# EAGLE design motocontrolscience (EAGLE 6.5.0)
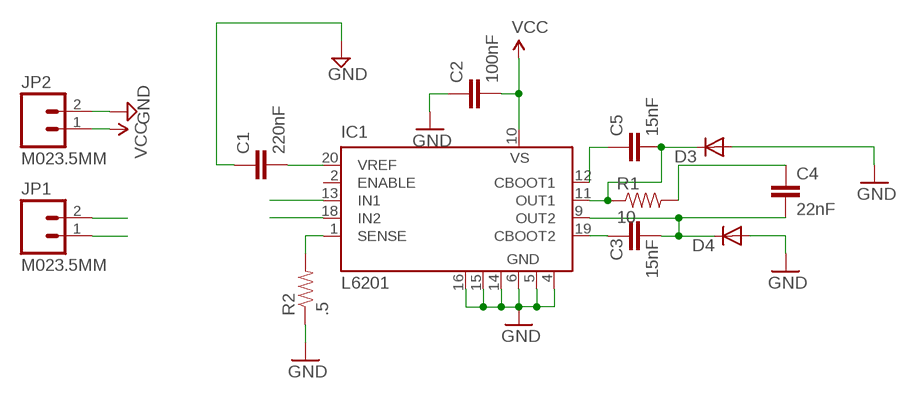
[diagram p0: schematic, sheet 1]

## Parts
C1  220nF  10UF-6.3V-20%(1206)  [1206]
C2  100nF  10UF-6.3V-20%(1206)  [1206]
C3  15nF  10UF-6.3V-20%(1206)  [1206]
C4  22nF  10UF-6.3V-20%(1206)  [1206]
C5  15nF  10UF-6.3V-20%(1206)  [1206]
D3  DIODE-DO214BA  [DO214BA]
D4  DIODE-DO214BA  [DO214BA]
IC1  L6201  [SO20]
JP1  M023.5MM  [SCREWTERMINAL-3.5MM-2]
JP2  M023.5MM  [SCREWTERMINAL-3.5MM-2]
R1  10  RESISTOR1206  [1206]
R2  .5  RESISTOR1206  [1206]

## Nets
GND: C1.1 C2.1 D3.A D4.A IC1.4(GND) IC1.5(GND) IC1.6(GND) IC1.14(GND) IC1.15(GND) IC1.16(GND) JP2.2 R2.1
N$2: C3.1 IC1.19(CBOOT2)
N$4: C4.1 R1.2
N$5: C5.1 IC1.12(CBOOT1)
N$6: C1.2 IC1.20(VREF)
N$7: IC1.1(SENSE) R2.2
N$8: IC1.13(IN1)
N$9: IC1.18(IN2)
OUT1: C5.2 D3.C IC1.11(OUT1) JP1.1 R1.1
OUT2: C3.2 C4.2 D4.C IC1.9(OUT2) JP1.2
VCC: C2.2 IC1.10(VS) JP2.1
Unconnected: IC1.2(ENABLE)

## Library data of the parts
C1-C5 = SparkFun-Capacitors:10UF-6.3V-20%(1206): CAP-10057 Ceramic; PROD_ID: CAP-10057; VALUE: 10uF
D3 D4 = diode:DIODE-: DIODE
IC1 = st-microelectronics:L620: DMOS FULL BRIDGE DRIVER; MF: Arrow Electronics; MPN: L6201; OC_FARNELL: 1271290; OC_NEWARK: 89K0750
JP1 JP2 = SparkFun-Connectors:M02: Standard 2-pin 0.1" header. Use with - straight break away headers ( PRT-00116) - right angle break away headers (PRT-00553) - swiss pins (PRT-00743) - machine pins (PRT-00117) - female headers (PRT-00115) Molex polarized connector foot print use with: PRT-08233 with associated crimp pins and housings. 2.54_SCREWTERM for use with PRT-10571. 3.5mm Screw Terminal footprints for PRT-08084 5mm Screw Terminal footprints for use with PRT-08432
R1 R2 = SparkFun-Passives:RESISTOR: Resistor Basic schematic elements and footprints for 0603, 1206, and PTH resistors.

## Board
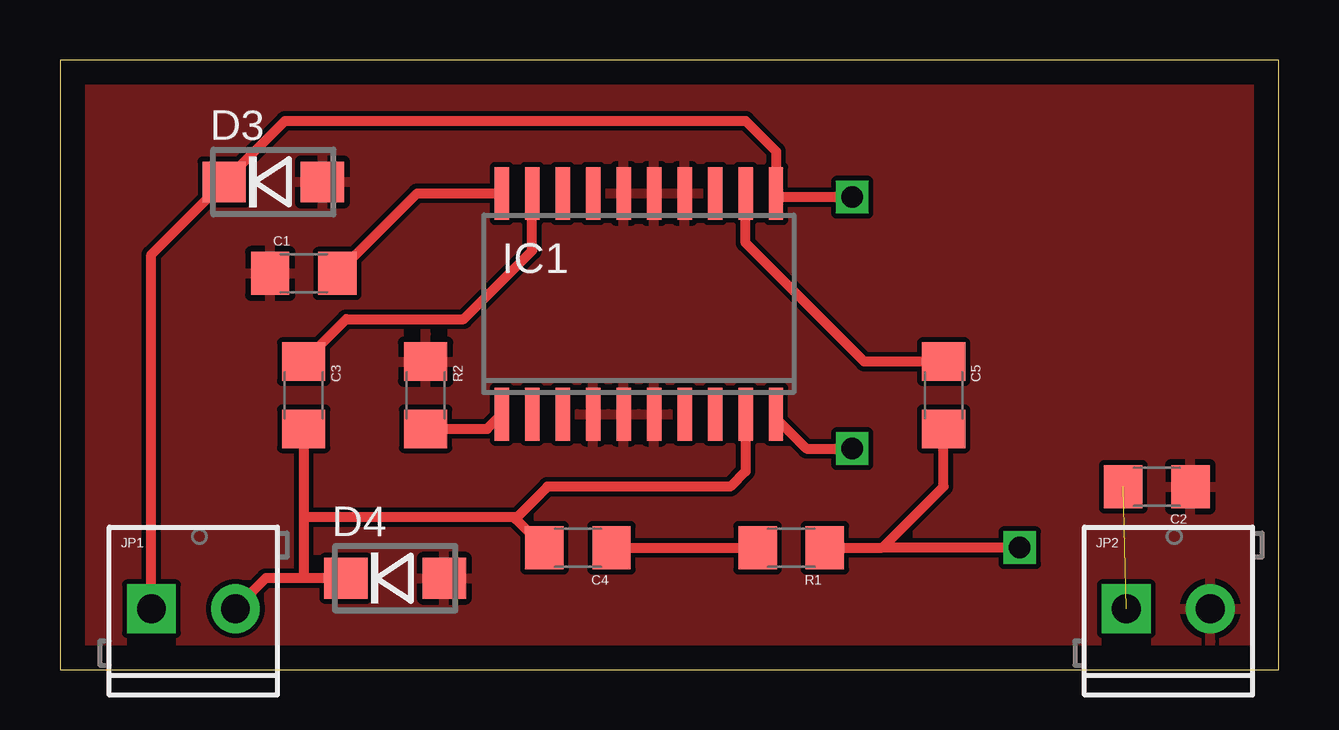
[diagram p1: board, top side]
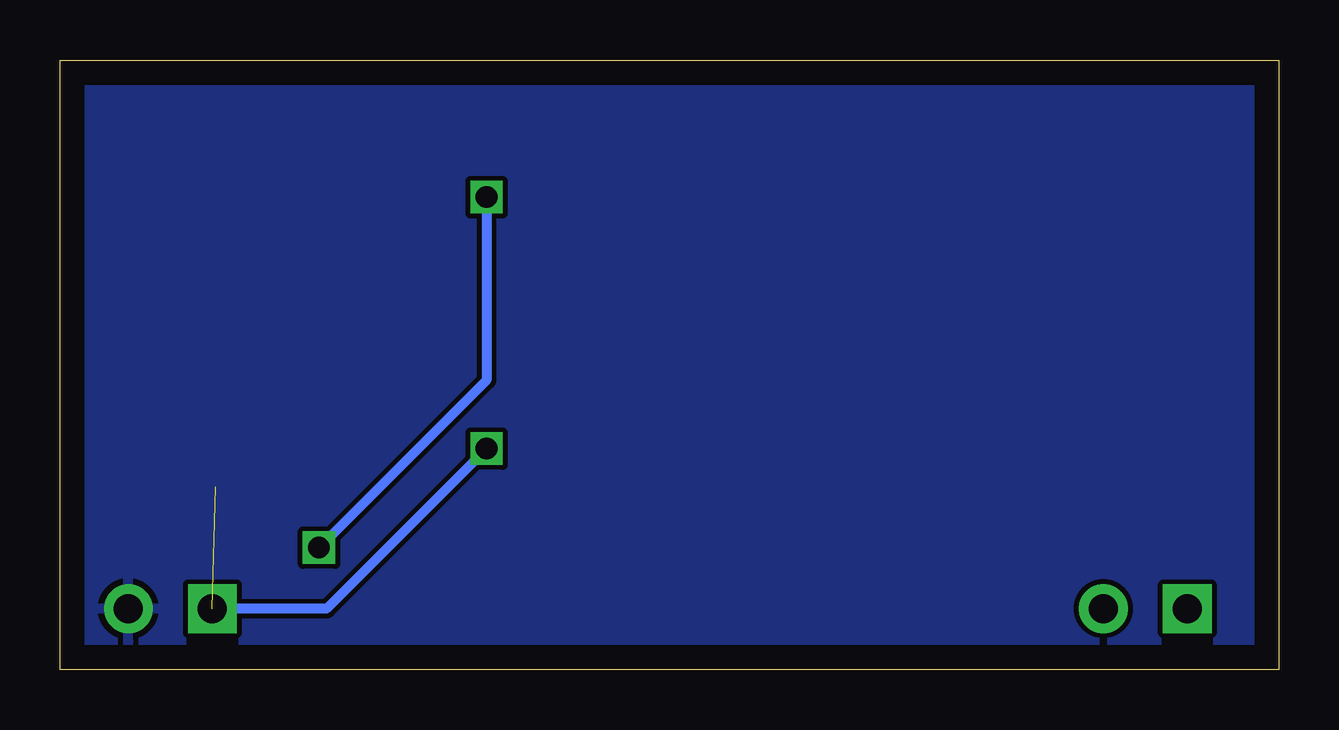
[diagram p2: board, bottom side, seen from below]

Size 50.8 x 25.4 mm. Coordinates in mm from the lower left corner, seen from the top.
Outline: 0,0 50.8,0 50.8,25.4 0,25.4 0,0
Copper layers (1*16): Top 0.035mm / dielectric 1.5mm / Bottom 0.035mm
Design rules "default": minimum track width 10mil, minimum drill 24mil, track to track 8mil, track to pad 8mil, pad to pad 8mil, via to via 8mil, smd to smd 8mil, copper to edge 40mil, drill to drill 8mil, minimum pad ring 10mil, minimum via ring 8mil, stop-mask expansion 4mil, vias tented up to drill 0mil, thermal gap 10mil

### Footprints (pad centres in the part's own frame; a part is rotated, then mirrored left to right if it is on the bottom)
1206 = smd 1.6 x 1.8: 1 -1.4,0; 2 1.4,0
DO214BA = smd 1.8 x 1.7: A 2.05,0; C -2.05,0
SO20 = smd 0.6 x 2.2: 1 -5.715,-4.6; 2 -4.445,-4.6; 3 -3.175,-4.6; 4 -1.905,-4.6; 5 -0.635,-4.6; 6 0.635,-4.6; 7 1.905,-4.6; 8 3.175,-4.6; 9 4.445,-4.6; 10 5.715,-4.6; 11 5.715,4.6; 12 4.445,4.6; 13 3.175,4.6; 14 1.905,4.6; 15 0.635,4.6; 16 -0.635,4.6; 17 -1.905,4.6; 18 -3.175,4.6; 19 -4.445,4.6; 20 -5.715,4.6
SCREWTERMINAL-3.5MM-2 = drill 1.2 pad 2.032 square: 1 0,0 | drill 1.2 pad 2.032: 2 3.5,0

### Placement (x,y rotation side)
C1  10.16,16.51 0 top
C2  45.72,7.62 180 top
C3  10.16,11.43 270 top
C4  21.59,5.08 180 top
C5  36.83,11.43 270 top
D3  8.89,20.32 0 top
D4  13.97,3.81 0 top
IC1  24.13,15.24 0 top
JP1  3.81,2.54 0 top
JP2  44.45,2.54 0 top
R1  30.48,5.08 180 top
R2  15.24,11.43 270 top

### Tracks (layer width: path | path; a pad name or v marks a point on that pad's centre or on a via)
GND
  pour Top: 0,50.8 0,0 50.8,0 50.8,50.8
  pour Bottom: -1.27,26.67 57.15,26.67 57.15,-7.62 -3.81,-7.62 -3.81,-5.08 -3.81,26.67
N$2
  Top 0.406: C3.1 11.94,14.61 16.83,14.61 19.68,17.46 IC1.19
N$4
  Top 0.406: C4.1 R1.2
N$5
  Top 0.406: C5.1 33.52,12.83 28.57,17.78 IC1.12
N$6
  Top 0.406: C1.2 14.89,19.84 IC1.20
N$7
  Top 0.406: R2.2 17.8,10.03 IC1.1
OUT1  (via drill 0.9)
  Top 0.406: JP1.1 3.81,17.29 D3.C 9.38,22.86 28.57,22.86 29.84,21.59 IC1.11 30,19.68 v33.02,19.68 | R1.1 34.29,5.08 | 34.29,5.08 36.83,7.62 C5.2 | v40.01,5.08 34.29,5.08
  Bottom 0.406: v33.02,19.68 33.02,12.06 v40.01,5.08
OUT2
  Top 0.406: D4.C 10.16,3.81 | 10.16,3.81 8.58,3.81 JP1.2 | C3.2 10.16,6.35 | 10.16,6.35 10.16,3.81 | C4.2 18.98,6.29 | 18.98,6.29 18.92,6.35 10.16,6.35 | IC1.9 28.57,8.26 27.94,7.62 20.32,7.62 18.98,6.29
VCC  (via drill 0.9)  (1 unrouted)
  Top 0.406: IC1.10 29.84,10.48 31.11,9.21 v33.02,9.21
  Bottom 0.406: v33.02,9.21 39.69,2.54 JP2.1